# Altium schematic sheet TB-S5D5_p03_MCU-v1.2.SchDoc: Renesas AE-CAP1-S3 Target Board
size Legal; Author: Jorge Amodio; Organization: Serious Integrated, Inc.; Address1: 145 s 79th Street; Address2: Suite 34; Address3: Chandler, AZ 85226; Address4: USA; DocumentNumber: 3; Revision: PCB02; SheetNumber: 3; SheetTotal: 5; CompanyURL: www.seriousintegrated.com; ReleaseDate: 8/12/2016; Version: v1.1; Company Name: Renesas Electronics America; PageSetup: Record=PageOptions|CenterHorizontal=True|CenterVertical=True|PrintScale=1.00|XCorrection=1.00|YCorrection=1.00|PrintKind=1|BorderSize=5000000|LeftOffset=0|BottomOffset=0|Orientation=2|PaperLength=1000|PaperWidth=1000|Scale=100|PaperSource=7|PrintQuality=-4|MediaType=1|DitherType=10|PaperKind=A5 148x210mm|PrintScaleMode=1
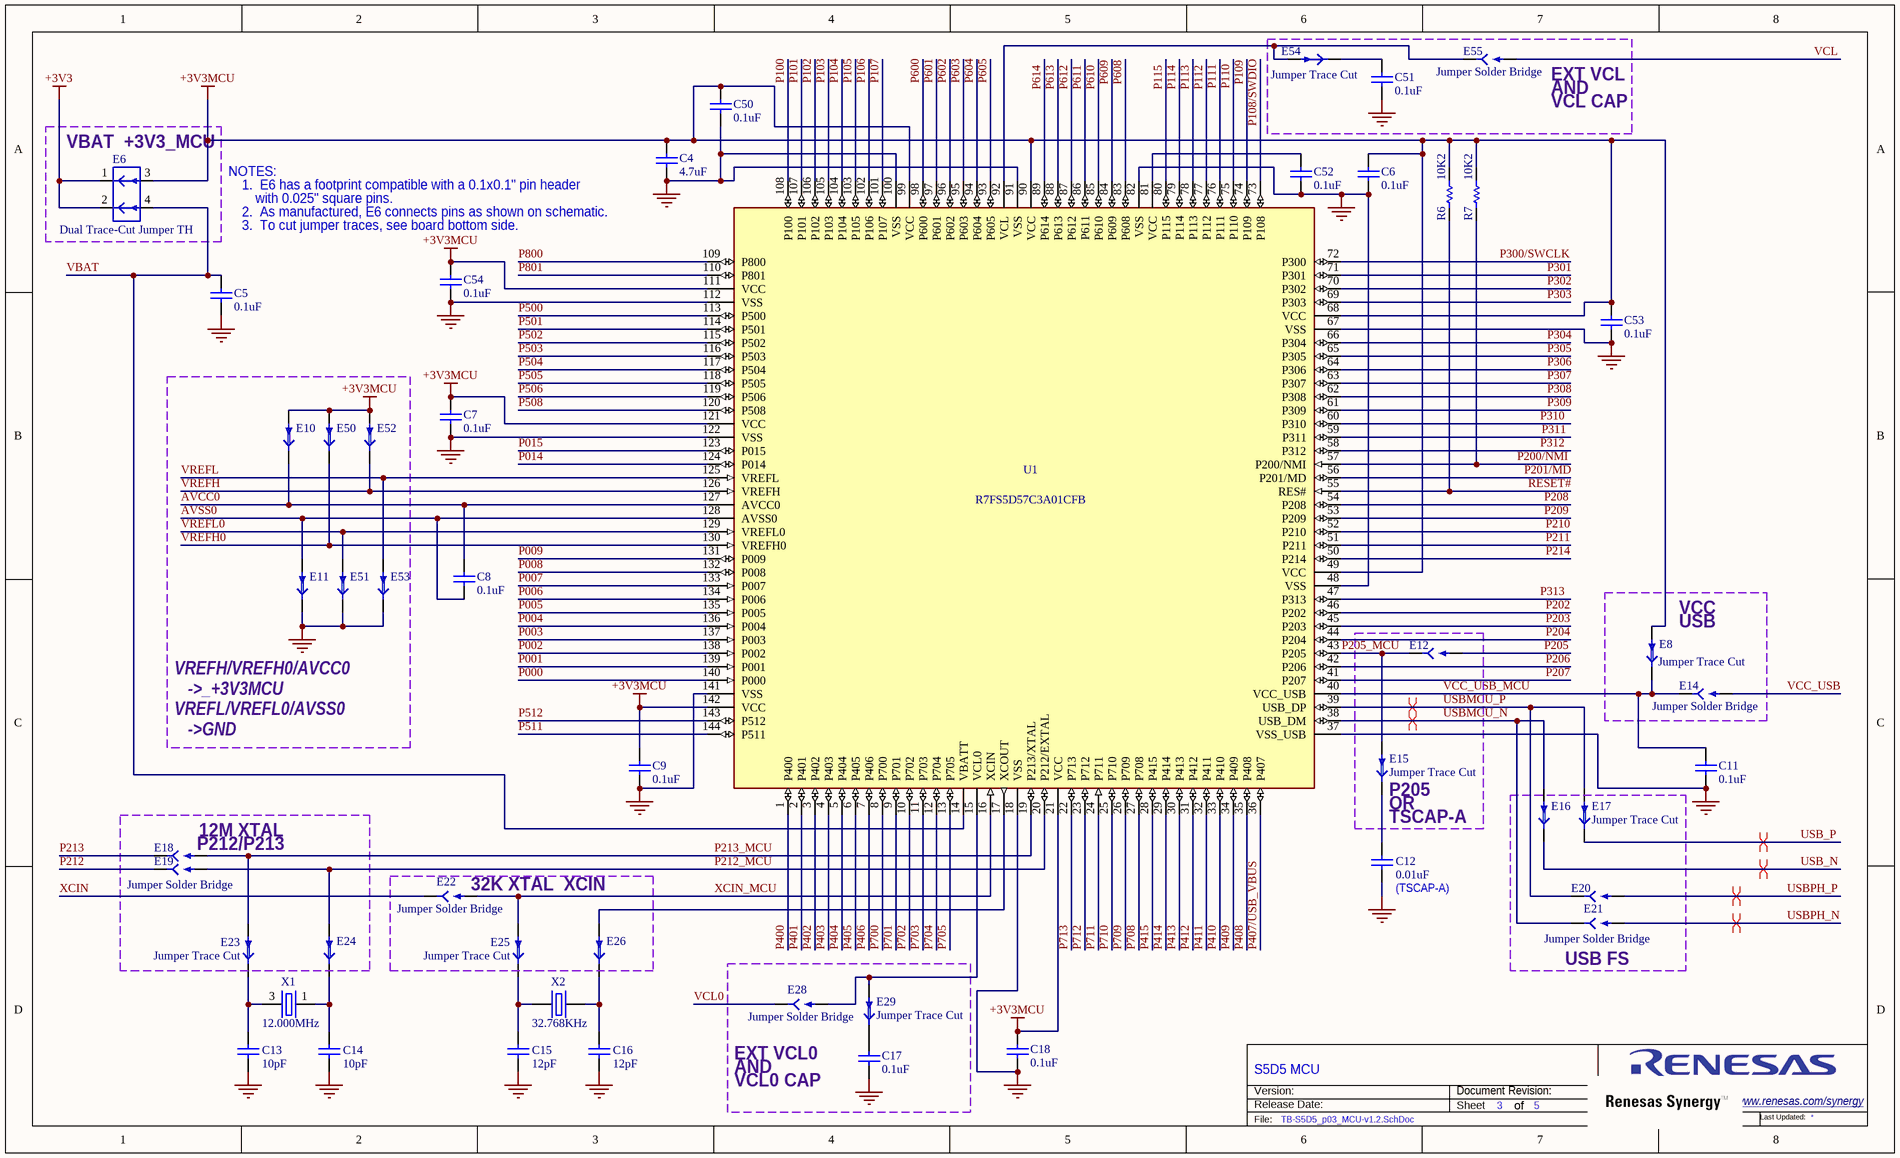
[diagram p0: TB-S5D5_p03_MCU-v1.2.SchDoc]

## Parts
C4  Capacitance: 4.7uF  [CAPC0603-01]  (hidden comment: CAP-000043-01)
C5  Capacitance: 0.1uF  [CAPC0603-01]  (hidden comment: CAP-000029-01)
C6  Capacitance: 0.1uF  [CAPC0603-01]  (hidden comment: CAP-000029-01)
C7  Capacitance: 0.1uF  [CAPC0603-01]  (hidden comment: CAP-000029-01)
C8  Capacitance: 0.1uF  [CAPC0603-01]  (hidden comment: CAP-000029-01)
C9  Capacitance: 0.1uF  [CAPC0603-01]  (hidden comment: CAP-000029-01)
C11  Capacitance: 0.1uF  [CAPC0603-01]  (hidden comment: CAP-000029-01)
C12  Capacitance: 0.01uF  [CAPC0402-01]  (hidden comment: CAP-000062-01)
C13  Capacitance: 10pF  [CAPC0201-01]  (hidden comment: CAP-000081-01)
C14  Capacitance: 10pF  [CAPC0201-01]  (hidden comment: CAP-000081-01)
C15  Capacitance: 12pF  [CAPC0402-01]  (hidden comment: CAP-000059-01)
C16  Capacitance: 12pF  [CAPC0402-01]  (hidden comment: CAP-000059-01)
C17  Capacitance: 0.1uF  [CAPC0603-01]  (hidden comment: CAP-000029-01)
C18  Capacitance: 0.1uF  [CAPC0603-01]  (hidden comment: CAP-000029-01)
C50  Capacitance: 0.1uF  [CAPC0603-01]  (hidden comment: CAP-000029-01)
C51  Capacitance: 0.1uF  [CAPC0603-01]  (hidden comment: CAP-000029-01)
C52  Capacitance: 0.1uF  [CAPC0603-01]  (hidden comment: CAP-000029-01)
C53  Capacitance: 0.1uF  [CAPC0603-01]  (hidden comment: CAP-000029-01)
C54  Capacitance: 0.1uF  [CAPC0603-01]  (hidden comment: CAP-000029-01)
E6  Dual Trace-Cut Jumper TH  [E_2x2pTH-TC100mil]  (net tie, no BOM)
E8  Jumper Trace Cut  [E_PadsTraceCut0805]  (net tie, no BOM)
E10  Jumper Trace Cut  [E_PadsTraceCut0805]  (value not drawn)  (net tie, no BOM)
E11  Jumper Trace Cut  [E_PadsTraceCut0805]  (value not drawn)  (net tie, no BOM)
E12  Jumper Solder Bridge  [E_PadsSplit0805]  (value not drawn)  (no BOM)
E14  Jumper Solder Bridge  [E_PadsSplit0805]  (no BOM)
E15  Jumper Trace Cut  [E_PadsTraceCut0805]  (net tie, no BOM)
E16  Jumper Trace Cut  [E_PadsTraceCut0805]  (value not drawn)  (net tie, no BOM)
E17  Jumper Trace Cut  [E_PadsTraceCut0805]  (net tie, no BOM)
E18  Jumper Solder Bridge  [E_PadsSplit0805]  (value not drawn)  (no BOM)
E19  Jumper Solder Bridge  [E_PadsSplit0805]  (no BOM)
E20  Jumper Solder Bridge  [E_PadsSplit0805]  (value not drawn)  (no BOM)
E21  Jumper Solder Bridge  [E_PadsSplit0805]  (no BOM)
E22  Jumper Solder Bridge  [E_PadsSplit0805]  (no BOM)
E23  Jumper Trace Cut  [E_PadsTraceCut0805]  (net tie, no BOM)
E24  Jumper Trace Cut  [E_PadsTraceCut0805]  (value not drawn)  (net tie, no BOM)
E25  Jumper Trace Cut  [E_PadsTraceCut0805]  (net tie, no BOM)
E26  Jumper Trace Cut  [E_PadsTraceCut0805]  (value not drawn)  (net tie, no BOM)
E28  Jumper Solder Bridge  [E_PadsSplit0805]  (no BOM)
E29  Jumper Trace Cut  [E_PadsTraceCut0805]  (net tie, no BOM)
E50  Jumper Trace Cut  [E_PadsTraceCut0805]  (value not drawn)  (net tie, no BOM)
E51  Jumper Trace Cut  [E_PadsTraceCut0805]  (value not drawn)  (net tie, no BOM)
E52  Jumper Trace Cut  [E_PadsTraceCut0805]  (value not drawn)  (net tie, no BOM)
E53  Jumper Trace Cut  [E_PadsTraceCut0805]  (value not drawn)  (net tie, no BOM)
E54  Jumper Trace Cut  [E_PadsTraceCut0805]  (net tie, no BOM)
E55  Jumper Solder Bridge  [E_PadsSplit0805]  (no BOM)
R6  Resistance: 10K2  [RESC0603-01]  (hidden comment: RES-000091-01)
R7  Resistance: 10K2  [RESC0603-01]  (hidden comment: RES-000091-01)
U1  Display Name: R7FS5D57C3A01CFB  [RENESAS_PLQP0144KA-B_N]  (hidden comment: ICN-R01001-01)
X1  Frequency: 12.000MHz  [TXC_7V]  (hidden comment: XTL-000011-01)
X2  Frequency: 32.768KHz  [ABRACON_ABS07]  (hidden comment: XTL-000006-01)

## Blocks framed on the sheet
VBAT  +3V3_MCU: E6
USB FS: E16 E17 E20 E21
32K XTAL  XCIN: E22 E25 E26

## Nets
+3V3: E6.1(A1) E6.2(A2)
+3V3MCU: C4.2 C6.1 C7.1 C9.1 C18.1 C50.1 C53.1 C54.1 E6.3(B1) E8.2(A) E10.2(A) E50.2(A) E52.2(A) R6.2 R7.2 U1.21(VCC) U1.49(VCC) U1.68(VCC) U1.90(VCC) U1.99(VCC) U1.111(VCC) U1.121(VCC) U1.142(VCC)
GND: C4.1 C5.2 C6.2 C7.2 C9.2 C11.2 C12.1 C13.1 C14.1 C15.1 C16.1 C17.2 C18.2 C50.2 C51.2 C52.2 C53.2 C54.2 E11.1(A) E51.1(A) E53.1(A) U1.18(VSS) U1.37(VSS_USB) U1.48(VSS) U1.67(VSS) U1.82(VSS) U1.91(VSS) U1.100(VSS) U1.112(VSS) U1.122(VSS) U1.141(VSS)
AVCC0: C8.1 E10.1(A) U1.127(AVCC0)
AVSS0: C8.2 E11.2(A) U1.128(AVSS0)
P000: U1.140(P000)
P001: U1.139(P001)
P002: U1.138(P002)
P003: U1.137(P003)
P004: U1.136(P004)
P005: U1.135(P005)
P006: U1.134(P006)
P007: U1.133(P007)
P008: U1.132(P008)
P009: U1.131(P009)
P014: U1.124(P014)
P015: U1.123(P015)
P100: U1.108(P100)
P101: U1.107(P101)
P102: U1.106(P102)
P103: U1.105(P103)
P104: U1.104(P104)
P105: U1.103(P105)
P106: U1.102(P106)
P107: U1.101(P107)
P108/SWDIO: U1.73(P108)
P109: U1.74(P109)
P110: U1.75(P110)
P111: U1.76(P111)
P112: U1.77(P112)
P113: U1.78(P113)
P114: U1.79(P114)
P115: U1.80(P115)
P200/NMI: R7.1 U1.57(P200/NMI)
P201/MD: U1.56(P201/MD)
P202: U1.46(P202)
P203: U1.45(P203)
P204: U1.44(P204)
P205: E12.2(A)
P205_MCU: E12.1(A) E15.2(A) U1.43(P205)
P206: U1.42(P206)
P207: U1.41(P207)
P208: U1.54(P208)
P209: U1.53(P209)
P210: U1.52(P210)
P211: U1.51(P211)
P212: E19.1(A)
P212_MCU: E19.2(A) E24.2(A) U1.20(P212/EXTAL)
P213: E18.1(A)
P213_MCU: E18.2(A) E23.2(A) U1.19(P213/XTAL)
P214: U1.50(P214)
P300/SWCLK: U1.72(P300)
P301: U1.71(P301)
P302: U1.70(P302)
P303: U1.69(P303)
P304: U1.66(P304)
P305: U1.65(P305)
P306: U1.64(P306)
P307: U1.63(P307)
P308: U1.62(P308)
P309: U1.61(P309)
P310: U1.60(P310)
P311: U1.59(P311)
P312: U1.58(P312)
P313: U1.47(P313)
P400: U1.1(P400)
P401: U1.2(P401)
P402: U1.3(P402)
P403: U1.4(P403)
P404: U1.5(P404)
P405: U1.6(P405)
P406: U1.7(P406)
P407/USB_VBUS: U1.36(P407)
P408: U1.35(P408)
P409: U1.34(P409)
P410: U1.33(P410)
P411: U1.32(P411)
P412: U1.31(P412)
P413: U1.30(P413)
P414: U1.29(P414)
P415: U1.28(P415)
P500: U1.113(P500)
P501: U1.114(P501)
P502: U1.115(P502)
P503: U1.116(P503)
P504: U1.117(P504)
P505: U1.118(P505)
P506: U1.119(P506)
P508: U1.120(P508)
P511: U1.144(P511)
P512: U1.143(P512)
P600: U1.98(P600)
P601: U1.97(P601)
P602: U1.96(P602)
P603: U1.95(P603)
P604: U1.94(P604)
P605: U1.93(P605)
P608: U1.83(P608)
P609: U1.84(P609)
P610: U1.85(P610)
P611: U1.86(P611)
P612: U1.87(P612)
P613: U1.88(P613)
P614: U1.89(P614)
P700: U1.8(P700)
P701: U1.9(P701)
P702: U1.10(P702)
P703: U1.11(P703)
P704: U1.12(P704)
P705: U1.13(P705)
P708: U1.27(P708)
P709: U1.26(P709)
P710: U1.25(P710)
P711: U1.24(P711)
P712: U1.23(P712)
P713: U1.22(P713)
P800: U1.109(P800)
P801: U1.110(P801)
RESET#: R6.1 U1.55(RES#)
USB_N: E16.1(A)
USB_P: E17.1(A)
USBMCU_N: E16.2(A) E21.1(A) U1.38(USB_DM)
USBMCU_P: E17.2(A) E20.1(A) U1.39(USB_DP)
USBPH_N: E21.2(A)
USBPH_P: E20.2(A)
VBAT: C5.1 E6.4(B2) U1.14(VBATT)
VCC_USB: E14.2(A)
VCC_USB_MCU: C11.1 E8.1(A) E14.1(A) U1.40(VCC_USB)
VCL: E55.2(A)
VCL0: E28.1(A)
VREFH: E52.1(A) U1.126(VREFH)
VREFH0: E50.1(A) U1.130(VREFH0)
VREFL: E53.2(A) U1.125(VREFL)
VREFL0: E51.2(A) U1.129(VREFL0)
XCIN: E22.1(A)
XCIN_MCU: E22.2(A) E25.2(A) U1.16(XCIN)
NetC12_2: C12.2 E15.1(A)
NetC13_2: C13.2 E23.1(A) X1.3
NetC14_2: C14.2 E24.1(A) X1.1
NetC15_2: C15.2 E25.1(A) X2.1
NetC16_2: C16.2 E26.1(A) X2.2
NetC17_1: C17.1 E29.1(A)
NetC51_1: C51.1 E54.1(A)
NetC52_1: C52.1 U1.81(VCC)
NetE26_2: E26.2(A) U1.17(XCOUT)
NetE28_2: E28.2(A) E29.2(A) U1.15(VCL0)
NetE54_2: E54.2(A) E55.1(A) U1.92(VCL)

## Layout directives
differential pair: USB_N, USB_P, USBMCU_N, USBMCU_P, USBPH_N, USBPH_P

## Notes on the sheet
- (near E55) EXT VCL
- (near E55) AND
- VCL CAP
- NOTES:
- (near C4) 1.  E6 has a footprint compatible with a 0.1x0.1" pin header
- 2.  As manufactured, E6 connects pins as shown on schematic.
- 3.  To cut jumper traces, see board bottom side.
- with 0.025" square pins.
- (near E8) VCC
- (near E8) USB
- VREFH/VREFH0/AVCC0
- ->_+3V3MCU
- VREFL/VREFL0/AVSS0
- ->GND
- (near E18) 12M XTAL
- (near E15) P205
- TSCAP-A
- (near E15) OR
- (near E18) P212/P213
- (near C12) (TSCAP-A)
- EXT VCL0
- AND
- VCL0 CAP
- S5D5 MCU
- Version:
- Release Date:
- Document Revision:
- Sheet
- of
- www.renesas.com/synergy <http://www.renesas.com/synergy>
- File:
- 60
- Last Updated:

## Library data of the parts
C4 = CAP-000043-01: Ceramic Chip Capacitor 0603 4.7uF 6.3V; Manufacturer: Samsung; Mfg Part Number: CL10A475KQ8NNNL; Dialectric: X5R; Tolerance: 10%; Voltage: 6.3V; Package: 0603
C5-C9 C11 C17 C18 C50-C54 = CAP-000029-01: Ceramic Chip Capacitor 0603 0.1uF 50V; Manufacturer: Samsung; Mfg Part Number: CL10B104KB8NNNC; Dialectric: X7R; Tolerance: 10%; Voltage: 50V; Package: 0603
C12 = CAP-000062-01: Ceramic Chip Capacitor 0402 0.01uF 50V; Manufacturer: Samsung; Mfg Part Number: CL05B103KB5NNNC; Dialectric: X7R; Tolerance: 10%; Voltage: 50V; Package: 0402
C13 C14 = CAP-000081-01: Ceramic Chip Capacitor 0201 10pF 25V; Manufacturer: Samsung; Mfg Part Number: CL03C100DA3GNNC; Dialectric: C0G; Tolerance: 10%; Voltage: 25V; Package: 0201
C15 C16 = CAP-000059-01: Ceramic Chip Capacitor 0402 12pF 50V; Manufacturer: Samsung; Mfg Part Number: CL05C120JB5NNNC; Dialectric: COG; Tolerance: 5%; Voltage: 50V; Package: 0402
E6 = E_JmpTCx2: Trace-Cut Jumper pair, pins 1->3 & 2->4 connected
E8 E10 E11 E15-E17 E23-E26 E29 E50-E54 = E_JmpTraceCut: Pads on PCB with Trace Between for Cutting to isolate
E12 E14 E18-E22 E28 E55 = E_JmpSldrBridge: Pads on PCB with Narrow Gap to allow Solder Bridging
R6 R7 = RES-000091-01: Chip Resistor Thick Film 0603 10K2 1% 1/10W; Manufacturer: NIC; Mfg Part Number: NRC06F1022TRF; Package: 0603; Power: 1/10W; Tolerance: 1%
U1 = ICN-R01001-01: Renesas S5D5 ARM Cortex M4 120MHz MCU LQFP144; Mfg Part Number: R7FS5D57C3A01CFB#AA0; Architecture: ARM Ctx M4; CAN: 1; FLASH DATA: 32KB; FLASH CODE: 1MB; RAM: 352KB; Manufacturer: Renesas; Max Clock Speed: 120MHz; Package: LQFP-144
X1 = XTL-000011-01: Crystal 12MHz 10pF; Manufacturer: Abracon; Mfg Part Number: ABM8G-12.000MHZ-B4Y-T; Freq Stability: +/-20ppm; Load Capacitance: 10pF
X2 = XTL-000006-01: Crystal 32.769KHz 12.5pF SMT; Manufacturer: Abracon; Mfg Part Number: ABS07-32.768KHZ-T; Freq Stability: +/- 20ppm; Load Capacitance: 12.5pF